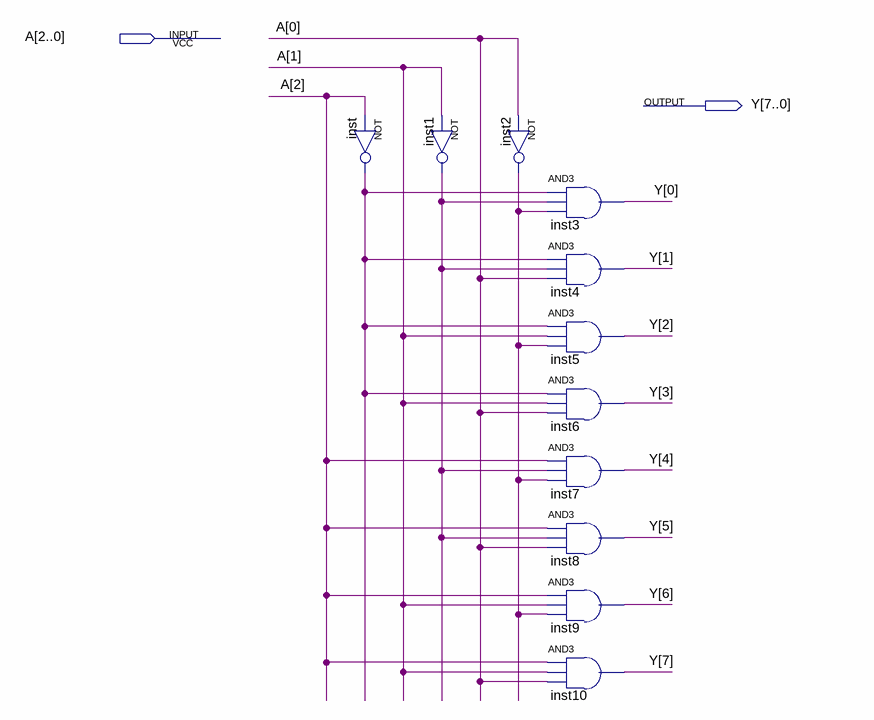
[diagram p0: schematic sheet]
// Quartus schematic decoder38.bdf as structural Verilog: 11 symbols, 2 pins
module decoder38 (
  input  [2:0] A,
  output [7:0] Y
);

  wire inst1_out, inst2_out, inst_out;

  not inst (inst_out, A[2]);
  not inst1 (inst1_out, A[1]);
  not inst2 (inst2_out, A[0]);
  and inst3 (Y[0], inst_out, inst1_out, inst2_out);
  and inst4 (Y[1], inst_out, inst1_out, A[0]);
  and inst5 (Y[2], inst_out, A[1], inst2_out);
  and inst6 (Y[3], inst_out, A[1], A[0]);
  and inst7 (Y[4], A[2], inst1_out, inst2_out);
  and inst8 (Y[5], A[2], inst1_out, A[0]);
  and inst9 (Y[6], A[2], A[1], inst2_out);
  and inst10 (Y[7], A[2], A[1], A[0]);
endmodule
